# EAGLE design addonv2 (EAGLE 6.6.0)
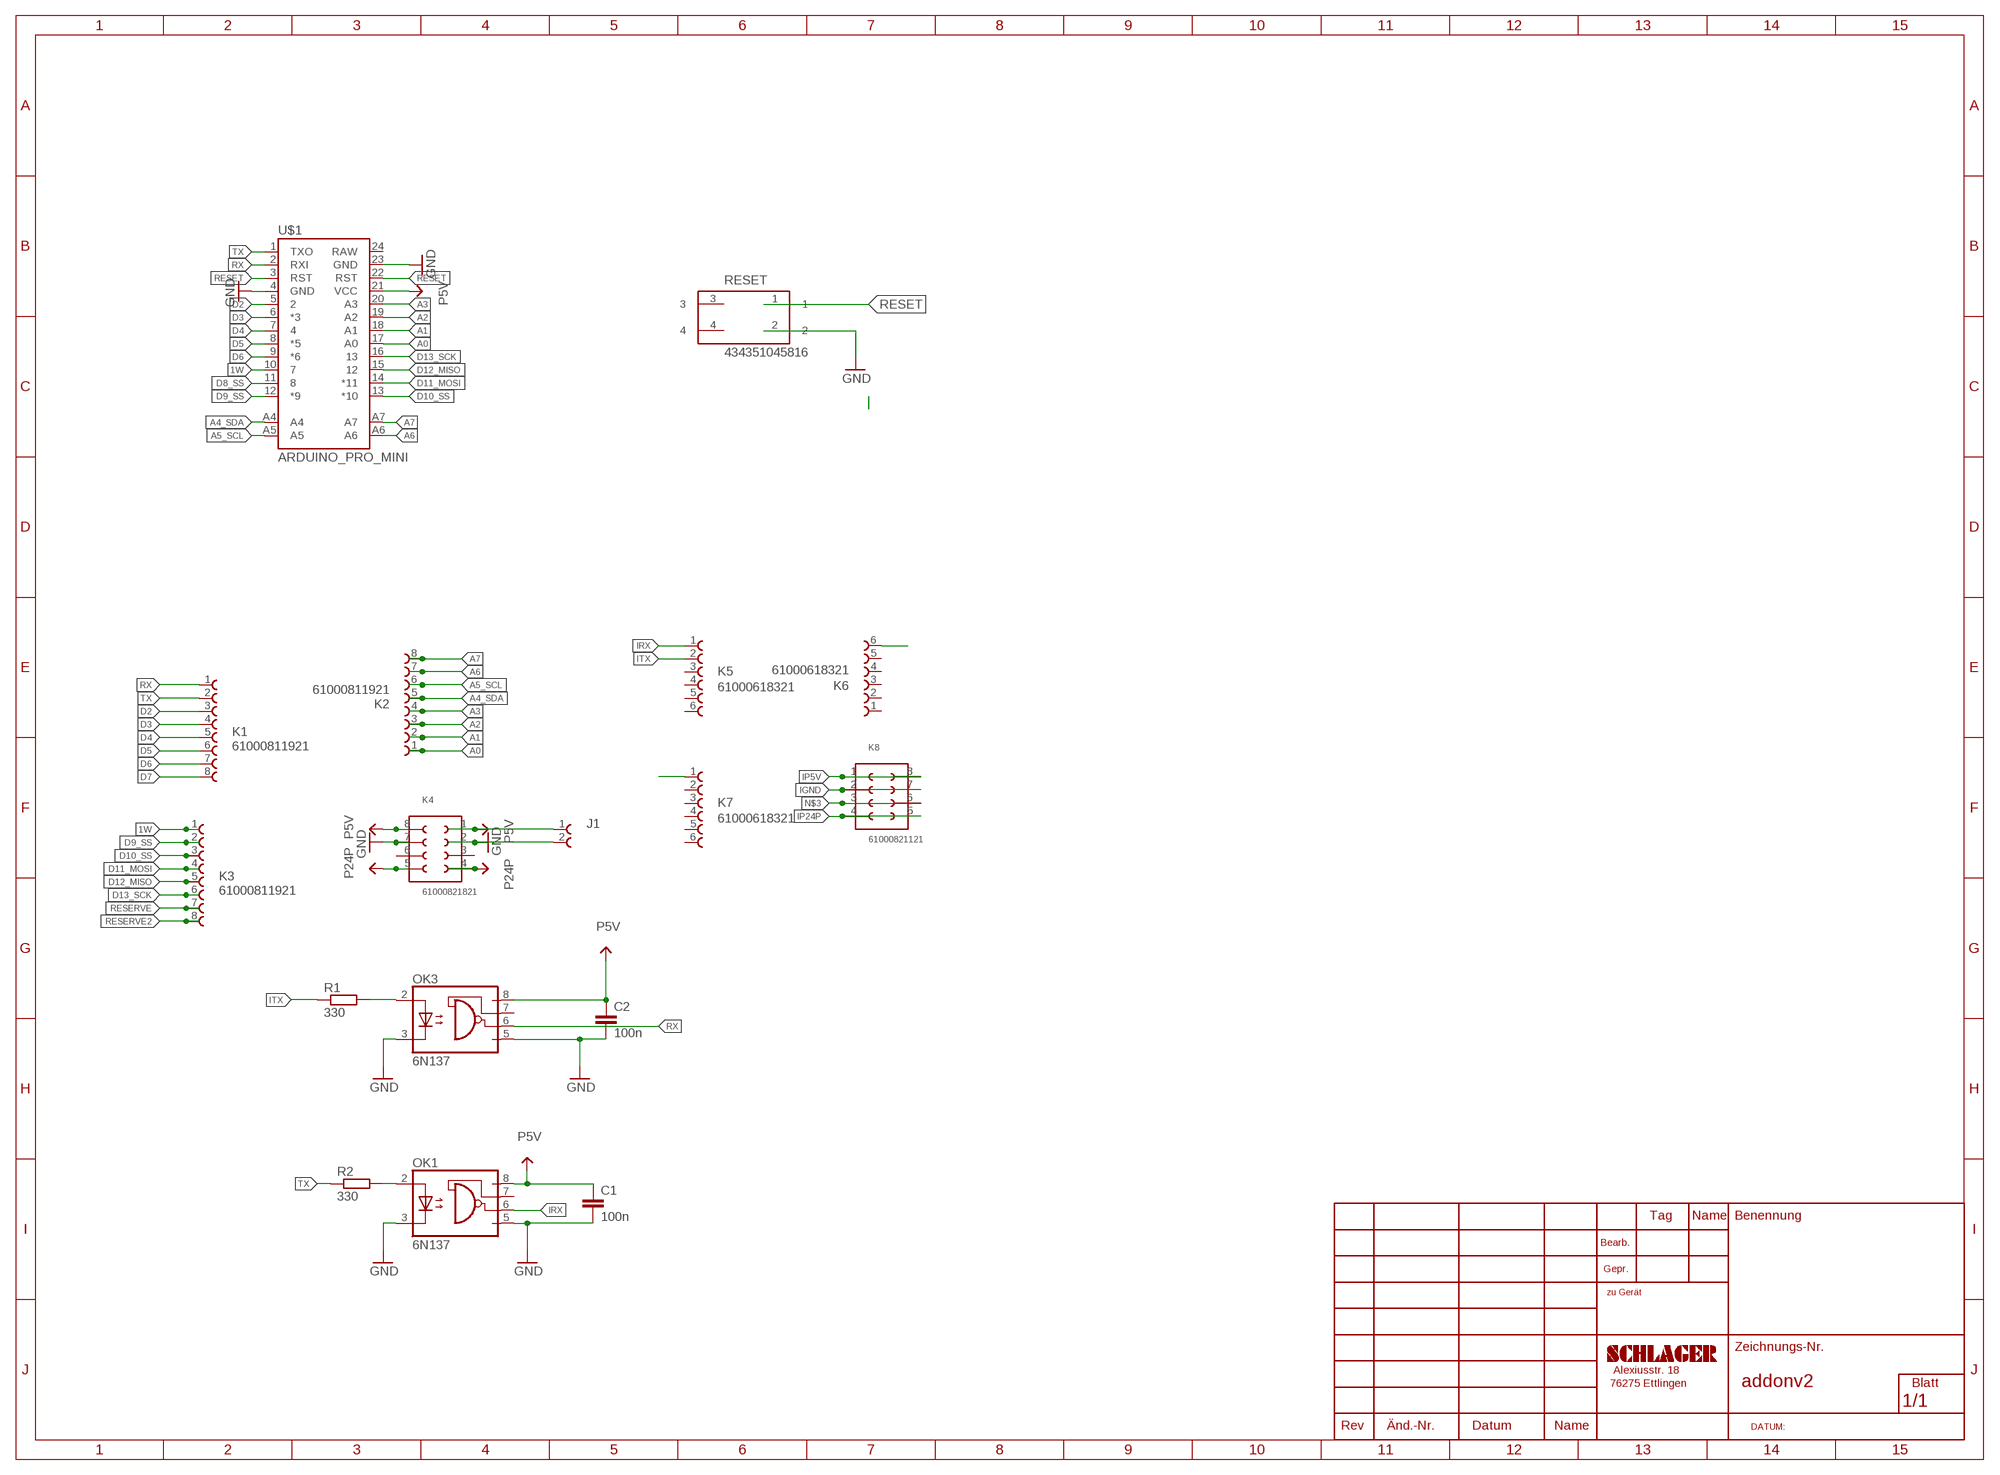
[diagram p0: schematic, sheet 1]

## Parts
C1  100n  C-EUC0805  [C0805]
C2  100n  C-EUC0805  [C0805]
J1  691322310002  [691322310002]
K1  61000811921  [61000811921]
K2  61000811921  [61000811921]
K3  61000811921  [61000811921]
K4  61000821821  [61000821821]
K5  61000618321  [61000618321]
K6  61000618321  [61000618321]
K7  61000618321  [61000618321]
K8  61000821121  [61000821121]
OK1  6N137  [DIL08]
OK3  6N137  [DIL08]
R1  330  R-EU_R0805  [R0805]
R2  330  R-EU_R0805  [R0805]
RESET  434351045816  [434351045816]
U$1  ARDUINO_PRO_MINI  [ARDUINO_PRO_MINI]

## Nets
1W: K3.1 U$1.10
A0: K2.1 U$1.17(A0)
A1: K2.2 U$1.18(A1)
A2: K2.3 U$1.19(A2)
A3: K2.4 U$1.20(A3)
A4_SDA: K2.5 U$1.A4
A5_SCL: K2.6 U$1.A5
A6: K2.7 U$1.A6
A7: K2.8 U$1.A7
D2: K1.3 U$1.5
D3: K1.4 U$1.6(*3)
D4: K1.5 U$1.7
D5: K1.6 U$1.8(*5)
D6: K1.7 U$1.9(*6)
D7: K1.8
D8_SS: U$1.11
D9_SS: K3.2 U$1.12(*9)
D10_SS: K3.3 U$1.13(*10)
D11_MOSI: K3.4 U$1.14(*11)
D12_MISO: K3.5 U$1.15
D13_SCK: K3.6 U$1.16
GND: C1.2 C2.2 J1.2 K4.2 K4.7 OK1.3(C) OK1.5(GND) OK3.3(C) OK3.5(GND) RESET.2 U$1.4(GND) U$1.23(GND)
IGND: K8.2 K8.7
IP5V: K8.1 K8.8
IP24P: K8.4 K8.5
IRX: K5.1 OK1.6(VO)
ITX: K5.2 R1.1
N$1: K7.1
N$2: K6.6
N$3: K8.3 K8.6
N$4: OK3.2(A) R1.2
N$5: OK1.2(A) R2.2
P5V: C1.1 C2.1 J1.1 K4.1 K4.8 OK1.8(VCC) OK3.8(VCC) U$1.21(VCC)
P24P: K4.4 K4.5
RESERVE: K3.7
RESERVE2: K3.8
RESET: RESET.1 U$1.3(RST) U$1.22(RST)
RX: K1.1 OK3.6(VO) U$1.2(RXI)
TX: K1.2 R2.1 U$1.1(TXO)
Unconnected: K4.3 K4.6 K5.3 K5.4 K5.5 K5.6 K6.1 K6.2 K6.3 K6.4 K6.5 K7.2 K7.3 K7.4 K7.5 K7.6 OK1.7(VE) OK3.7(VE) RESET.3 RESET.4 U$1.24(RAW)

## Library data of the parts
C1 C2 = debauer_passiv:C-EU: CAPACITOR, European symbol
J1 = Wuerth_TERMINAL_BLOCKS_rev16a:691322310002: WR-TBL Serie 322 - 3.81mm Vertical PCB Header , 2 Pins=>Code : Con_TBL_Pluggable_3.81_PCB_THT_Simple_691322310002 <http://katalog.we-online.de/media/images/eican/Con_TBL_Pluggable_3.81_PCB_THT_Simple_6913223100xx_pf2.jpg> Details see: http://katalog.we-online.de/en/em/691_322_310_0xx Created 2014-06-19, Karrer Zheng 2014 (C) Würth Elektronik
K1-K3 = Wuerth_Board-to-Board:61000811921: WR-PHD 2.54mm SMT Socket Header, 8 Pins=>Code : CON_BTB_SHD_2.54_1_SMT_61000811921 <http://katalog.we-online.de/media/images/eican/Con_BTB_SHD_2.54_1_SMT_6100xx11921_pf2.jpg> Details see: http://katalog.we-online.de/en/em/610_0xx_119_21 Created 2014-05-30, Karrer Zheng 2014 (C) Würth Elektronik
K4 = Wuerth_Board-to-Board:61000821821: WR-PHD 2.54mm Dual SMT Socket Header, 8 Pins=>Code : Con_BTB_SHD_2.54_1_SMT_61000821821 <http://katalog.we-online.de/media/images/eican/Con_BTB_SHD_2.54_1_SMT_6100xx21821_pf2.jpg> Details see: http://katalog.we-online.de/en/em/610_0xx_218_21 Created 2014-06-03, Karrer Zheng 2014 (C) Würth Elektronik
K5-K7 = Wuerth_Board-to-Board:61000618321: WR-PHD 2.54mm SMT Pin Header, 6 Pins =>Code : Con_BTB_PHD_2.54_1_SMT_61000618321 <http://katalog.we-online.de/media/images/eican/Con_BTB_PHD_2.54_1_SMT_6100xx18221_pf2.jpg> Details see: http://katalog.we-online.de/en/em/610_0xx_182_21 Created 2014-05-29, Karrer Zheng 2014 (C) Würth Elektronik
K8 = Wuerth_Board-to-Board:61000821121: WR-PHD 2.54mm Dual SMT Pin Header, 8 Pins =>Code : Con_BTB_PHD_2.54_2_61000821121 <http://katalog.we-online.de/media/images/eican/Con_BTB_PHD_2.54_2_6100xx21121_pf2.jpg> Details see: http://katalog.we-online.de/en/em/610_0xx_211_21 Created 2014-05-29, Karrer Zheng 2014 (C) Würth Elektronik
OK1 OK3 = optocoupler:6N137: MOTOROLA OPTO COUPLER; MPN: 6N137; OC_FARNELL: 1328376; OC_NEWARK: 52M1895
R1 R2 = debauer_passiv:R-EU_: RESISTOR, European symbol
RESET = Illuminated_Switches:434351045816: WS-TUS-3.5x4.7 mm side push SMD Tact Switch, 4 pins
U$1 = SparkFun-Boards:ARDUINO_PRO_MINI

## Net classes
4 USBpair: width 0.254 mm, drill 0.406 mm, clearance 0.508 mm

## Board
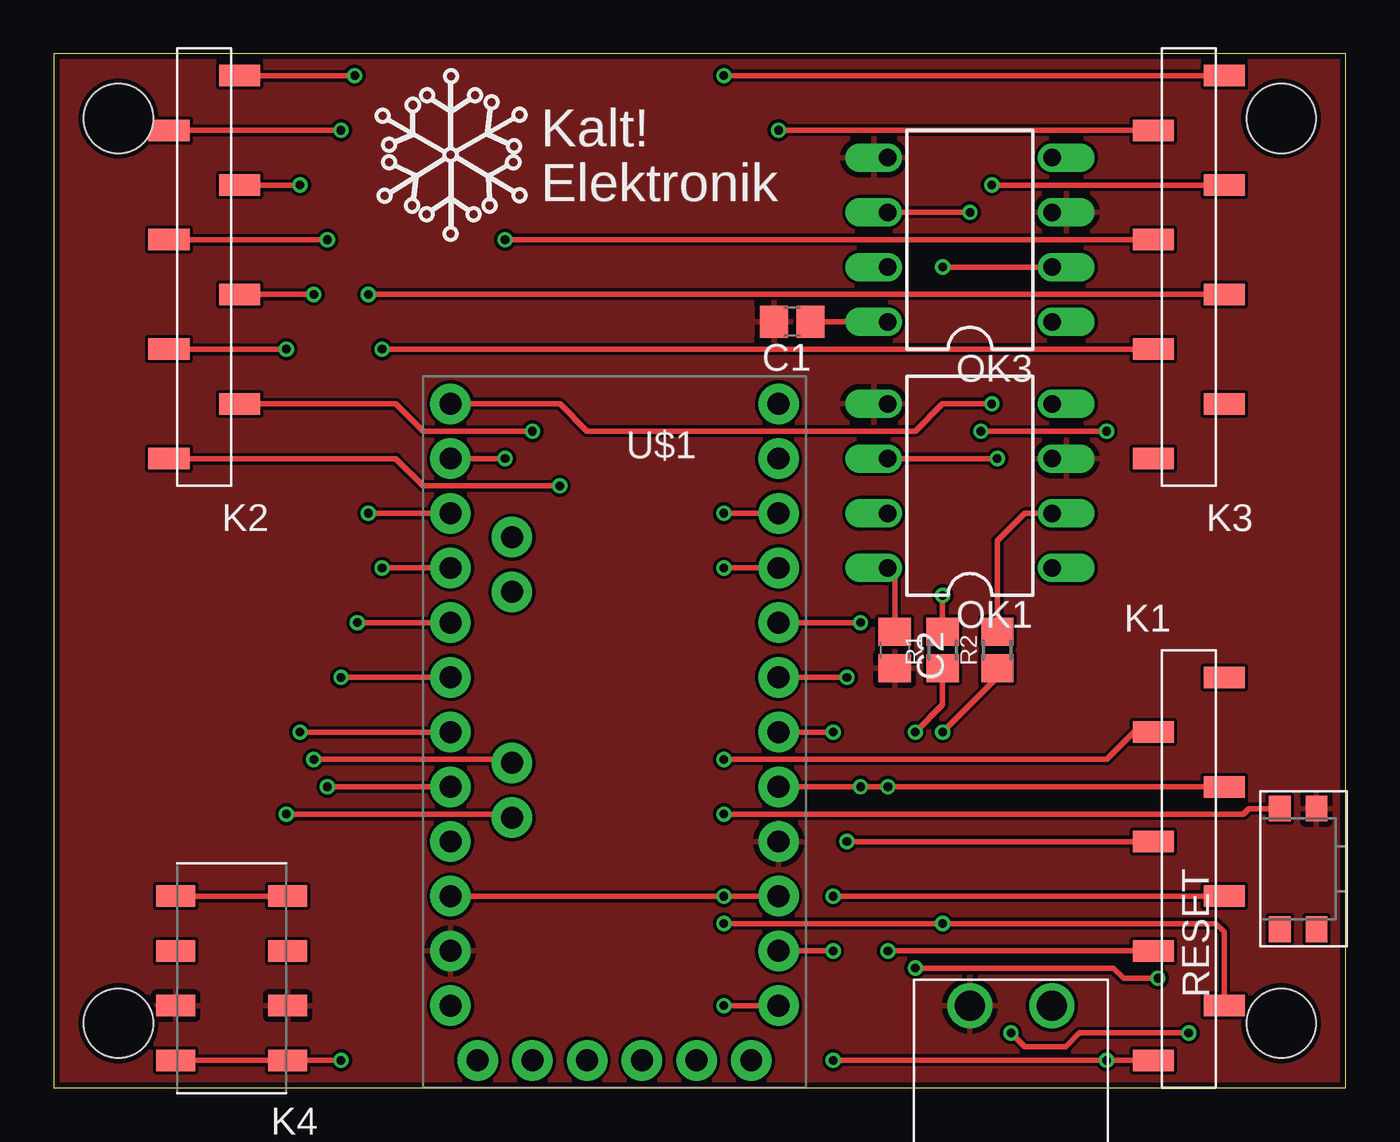
[diagram p1: board, top side]
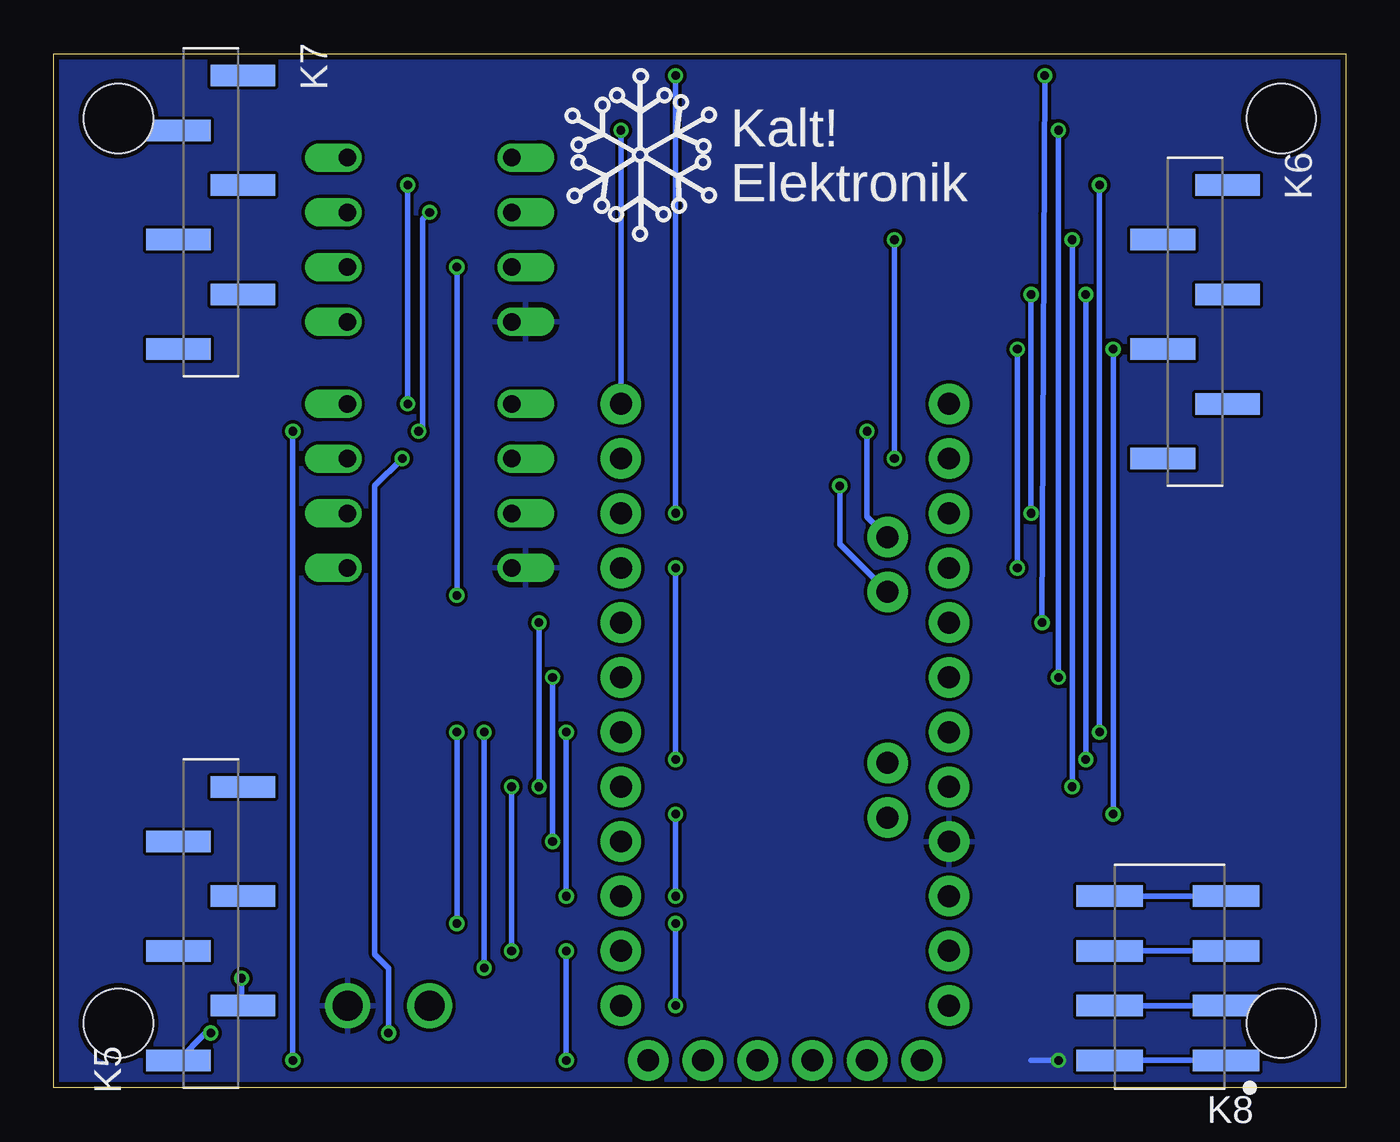
[diagram p2: board, bottom side, seen from below]

Size 60 x 48 mm. Coordinates in mm from the lower left corner, seen from the top.
Outline: 0,0 60,0 60,48 0,48 0,0
Copper layers (1*16): Top 0.035mm / dielectric 1.5mm / Bottom 0.035mm
Design rules "ITEADstudio_DRC": minimum track width 6mil, minimum drill 12mil, track to track 6mil, track to pad 6mil, pad to pad 6mil, via to via 6mil, smd to smd 0mil, copper to edge 10mil, drill to drill 10mil, minimum pad ring 10mil, minimum via ring 6mil, stop-mask expansion 2mil, vias tented up to drill 100mil, thermal gap 10mil
Holes 3.2 mm at 57,45 57,3 3,45 3,3

### Footprints (pad centres in the part's own frame; a part is rotated, then mirrored left to right if it is on the bottom)
C0805 = smd 1.3 x 1.5: 1 -0.85,0; 2 0.85,0
691322310002 = drill 1.4: 1 -3.81,0; 2 0,0
61000811921 = smd 1 x 1.91: 1 8.89,-1.645; 2 6.35,1.645; 3 3.81,-1.645; 4 1.27,1.645; 5 -1.27,-1.645; 6 -3.81,1.645; 7 -6.35,-1.645; 8 -8.89,1.645
61000821821 = smd 1 x 1.8: 1 -3.81,2.6; 2 -1.27,2.6; 3 1.27,2.6; 4 3.81,2.6; 5 3.81,-2.6; 6 1.27,-2.6; 7 -1.27,-2.6; 8 -3.81,-2.6
61000618321 = smd 1 x 3: 1 -8.89,1.5; 2 -6.35,-1.5; 3 -3.81,1.5; 4 -1.27,-1.5; 5 1.27,1.5; 6 3.81,-1.5
61000821121 = smd 1 x 3.1: 1 -6.35,-2.7; 2 -3.81,-2.7; 3 -1.27,-2.7; 4 1.27,-2.7; 5 1.27,2.7; 6 -1.27,2.7; 7 -3.81,2.7; 8 -6.35,2.7
DIL08 = drill 0.813 offset: 1 -3.81,-3.81; 2 -1.27,-3.81; 3 1.27,-3.81; 4 3.81,-3.81; 5 3.81,3.81; 6 1.27,3.81; 7 -1.27,3.81; 8 -3.81,3.81
R0805 = smd 1.3 x 1.5: 1 -0.85,0; 2 0.85,0
434351045816 = smd 1.2 x 1: 1 2.8,0.85; 2 2.8,-0.85; 3 -2.8,0.85; 4 -2.8,-0.85
ARDUINO_PRO_MINI = drill 1.016 pad 1.88: 1 -7.62,12.7; 2 -7.62,10.16; 3 -7.62,7.62; 4 -7.62,5.08; 5 -7.62,2.54; 6 -7.62,0; 7 -7.62,-2.54; 8 -7.62,-5.08; 9 -7.62,-7.62; 10 -7.62,-10.16; 11 -7.62,-12.7; 12 -7.62,-15.24; 13 7.62,-15.24; 14 7.62,-12.7; 15 7.62,-10.16; 16 7.62,-7.62; 17 7.62,-5.08; 18 7.62,-2.54; 19 7.62,0; 20 7.62,2.54; 21 7.62,5.08; 22 7.62,7.62; 23 7.62,10.16; 24 7.62,12.7; A4 4.763,1.429; A5 4.763,3.969; A6 4.763,-9.049; A7 4.763,-6.509; BLK -6.35,15.24; GND -3.81,15.24; GRN 6.35,15.24; RXI 1.27,15.24; TXO 3.81,15.24; VCC -1.27,15.24

### Placement (x,y rotation side)
C1  34.3,35.56 180 top
C2  39.06,20.32 270 top
J1  42.55,3.81 180 top
K1  52.71,10.16 270 top
K2  6.99,38.1 90 top
K3  52.71,38.1 90 top
K4  8.26,5.08 90 top
K5  52.71,10.16 90 bottom
K6  6.99,33.02 270 bottom
K7  52.71,38.1 270 bottom
K8  8.26,7.62 90 bottom
OK1  42.55,27.94 90 top
OK3  42.55,39.37 90 top
R1  41.28,20.32 90 top
R2  43.82,20.32 90 top
RESET  57.79,10.16 90 top
U$1  26.04,16.51 180 top
U$2  [KALT!ELEKTRONIK]  24.14,43.69 0 top
U$3  [KALT!ELEKTRONIK]  27.06,43.69 0 bottom

### Tracks (layer width: path | path; a pad name or v marks a point on that pad's centre or on a via)
1W  (via drill 0.4)
  Top 0.254: K3.1 v31.12,46.99 | v31.12,26.67 U$1.10
  Bottom 0.254: v31.12,46.99 v31.12,26.67
A0  (via drill 0.4)
  Top 0.254: K2.1 v13.98,46.99 | v14.1,21.59 U$1.17
  Bottom 0.254: v13.98,46.99 v14.1,21.59
A1  (via drill 0.4)
  Top 0.254: K2.2 v13.34,44.45 | U$1.18 v13.34,19.05
  Bottom 0.254: v13.34,44.45 v13.34,19.05
A2  (via drill 0.4)
  Top 0.254: K2.3 v11.44,41.91 | v11.44,16.51 U$1.19
  Bottom 0.254: v11.44,41.91 v11.44,16.51
A3  (via drill 0.4)
  Top 0.254: K2.4 v12.7,39.37 | v12.7,13.97 U$1.20
  Bottom 0.254: v12.7,39.37 v12.7,13.97
A4_SDA  (via drill 0.4)
  Top 0.254: K2.5 v12.07,36.83 | v12.07,15.24 21.12,15.24 U$1.A4
  Bottom 0.254: v12.07,36.83 v12.07,15.24
A5_SCL  (via drill 0.4)
  Top 0.254: K2.6 v10.8,34.29 | v10.8,12.7 21.12,12.7 U$1.A5
  Bottom 0.254: v10.8,34.29 v10.8,12.7
A6  (via drill 0.4)
  Top 0.254: K2.7 15.88,31.75 17.15,30.48 v22.23,30.48
  Bottom 0.254: v22.23,30.48 22.23,26.51 U$1.A6
A7  (via drill 0.4)
  Top 0.254: K2.8 15.88,29.21 17.15,27.94 v23.5,27.94
  Bottom 0.254: v23.5,27.94 23.5,25.24 U$1.A7
D2  (via drill 0.4)
  Top 0.254: K1.3 v38.74,6.35 | v38.74,13.97 U$1.5
  Bottom 0.254: v38.74,6.35 v38.74,13.97
D3  (via drill 0.4)
  Top 0.254: K1.4 v36.2,8.89 | v36.2,16.51 U$1.6
  Bottom 0.254: v36.2,8.89 v36.2,16.51
D4  (via drill 0.4)
  Top 0.254: K1.5 v36.83,11.43 | v36.83,19.05 U$1.7
  Bottom 0.254: v36.83,11.43 v36.83,19.05
D5  (via drill 0.4)
  Top 0.254: K1.6 v37.47,13.97 | v37.47,21.59 U$1.8
  Bottom 0.254: v37.47,13.97 v37.47,21.59
D6  (via drill 0.4)
  Top 0.254: K1.7 50.17,16.51 48.9,15.24 v31.12,15.24 | v31.12,24.13 U$1.9
  Bottom 0.254: v31.12,15.24 v31.12,24.13
D9_SS  (via drill 0.4)
  Top 0.254: K3.2 v33.66,44.45
  Bottom 0.254: v33.66,44.45 U$1.12
D10_SS  (via drill 0.4)
  Top 0.254: K3.3 v43.57,41.91 | v43.57,31.75 41.28,31.75 40.01,30.48 24.77,30.48 23.5,31.75 U$1.13
  Bottom 0.254: v43.57,41.91 v43.57,31.75
D11_MOSI  (via drill 0.4)
  Top 0.254: K3.4 v20.96,39.37 | v20.96,29.21 U$1.14
  Bottom 0.254: v20.96,39.37 v20.96,29.21
D12_MISO  (via drill 0.4)
  Top 0.254: v14.61,26.67 U$1.15 | K3.5 v14.61,36.83
  Bottom 0.254: v14.61,36.83 v14.61,26.67
D13_SCK  (via drill 0.4)
  Top 0.254: v15.24,24.13 U$1.16 | K3.6 v15.24,34.29
  Bottom 0.254: v15.24,34.29 v15.24,24.13
GND
  pour Top (rank 5): -86.2,68.58 67.95,68.58 67.95,-30.48 -86.51,-30.32
IGND
  Bottom 0.254: K8.2 K8.7
IP5V
  Bottom 0.254: K8.8 K8.1
IP24P
  Bottom 0.254: K8.4 K8.5
IRX  (via drill 0.4)
  Top 0.254: v44.45,2.54 45.09,1.91 47,1.91 47.63,2.54 v52.71,2.54 | v43.82,29.21 OK1.6
  Bottom 0.254: v44.45,2.54 44.45,5.56 45.09,6.19 45.09,27.94 v43.82,29.21 | v52.71,2.54 52.94,2.54 K5.1
ITX  (via drill 0.4)
  Top 0.254: v40.01,5.56 49.22,5.56 49.69,5.08 v51.28,5.08 | R1.1 41.28,17.78 v40.01,16.51
  Bottom 0.254: v40.01,16.51 v40.01,5.56 | v51.28,5.08 51.28,3.88 K5.2
N$3
  Bottom 0.254: K8.6 K8.3
N$4  (via drill 0.4)
  Top 0.254: OK3.2 v41.28,38.1 | v41.28,22.86 R1.2
  Bottom 0.254: v41.28,38.1 v41.28,22.86
N$5
  Top 0.254: OK1.2 45.09,26.67 43.82,25.4 R2.2
P5V  (via drill 0.4)
  Top 0.254: K4.1 K4.8 v13.34,1.27 | C1.1 OK3.8 | C2.1 39.06,23.81 OK1.8
  Bottom 0.254: v13.34,1.27 14.61,1.27
  pour Bottom: -86.74,73.15 83.95,73.15 83.95,-31.5 -86.74,-31.5
P24P
  Top 0.254: K4.4 K4.5
RESET  (via drill 0.4)
  Top 0.254: U$1.22 U$1.3 v31.12,8.89 | RESET.1 55.51,12.96 55.25,12.7 v31.12,12.7
  Bottom 0.254: v31.12,12.7 v31.12,8.89
RX  (via drill 0.4)
  Top 0.254: v36.2,1.27 v48.9,1.27 K1.1 | v36.2,6.35 U$1.2 | v42.55,40.64 OK3.6 | v43.06,30.48 v48.9,30.48
  Bottom 0.254: v36.2,1.27 v36.2,6.35 | v42.55,40.64 42.87,40.32 42.87,30.67 v43.06,30.48 | v48.9,30.48 v48.9,1.27
TX  (via drill 0.4)
  Top 0.254: K1.2 54.36,7.25 53.98,7.62 v41.28,7.62 v31.12,7.62 | v31.12,3.81 U$1.1 | R2.1 43.82,19.05 v41.28,16.51
  Bottom 0.254: v31.12,7.62 v31.12,3.81 | v41.28,16.51 v41.28,7.62